# EAGLE schematic resistor (EAGLE 9.5.1)
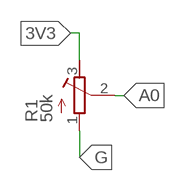
[diagram p0: schematic, sheet 1]

## Parts
R1  50k  R-TRIMM3296W  [RTRIM3296W]

## Nets
3V3: R1.3(A)
A0: R1.2(S)
G: R1.1(E)

## Library data of the parts
R1 = resistor:R-TRIMM: Trimm resistor